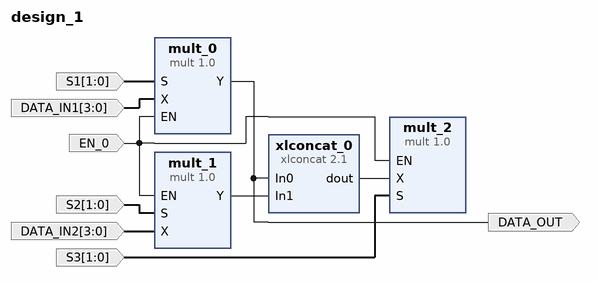
[diagram p0: block diagram of the top level]
# Vivado block design design_1, xc7z020clg484-1, Vivado 2018.2
create_bd_design design_1

create_bd_port -dir I EN_0
create_bd_port -dir O DATA_OUT
create_bd_port -dir I -from 1 -to 0 S1
create_bd_port -dir I -from 1 -to 0 S2
create_bd_port -dir I -from 3 -to 0 DATA_IN1
create_bd_port -dir I -from 3 -to 0 DATA_IN2
create_bd_port -dir I -from 1 -to 0 S3

create_bd_cell -type ip -vlnv xilinx.com:user:mult:1.0 mult_0
create_bd_cell -type ip -vlnv xilinx.com:user:mult:1.0 mult_1
create_bd_cell -type ip -vlnv xilinx.com:user:mult:1.0 mult_2
create_bd_cell -type ip -vlnv xilinx.com:ip:xlconcat:2.1 xlconcat_0
set_property -dict {CONFIG.IN0_WIDTH 2 CONFIG.IN1_WIDTH 2} [get_bd_cells xlconcat_0]

# ---- connections ----

connect_bd_net -net EN_0_1 [get_bd_ports EN_0] [get_bd_pins mult_0/EN] [get_bd_pins mult_1/EN] [get_bd_pins mult_2/EN]
connect_bd_net -net S2_1 [get_bd_ports S2] [get_bd_pins mult_1/S]
connect_bd_net -net S1_1 [get_bd_ports S1] [get_bd_pins mult_0/S]
connect_bd_net [get_bd_pins mult_0/Y] [get_bd_pins xlconcat_0/In0] [get_bd_ports DATA_OUT]
connect_bd_net [get_bd_pins mult_1/Y] [get_bd_pins xlconcat_0/In1]
connect_bd_net [get_bd_pins xlconcat_0/dout] [get_bd_pins mult_2/X]
connect_bd_net -net DATA_IN1_1 [get_bd_ports DATA_IN1] [get_bd_pins mult_0/X]
connect_bd_net -net DATA_IN2_1 [get_bd_ports DATA_IN2] [get_bd_pins mult_1/X]
connect_bd_net -net S3_1 [get_bd_ports S3] [get_bd_pins mult_2/S]

validate_bd_design
save_bd_design
